# Altium schematic sheet sdcard.SchDoc
size A4
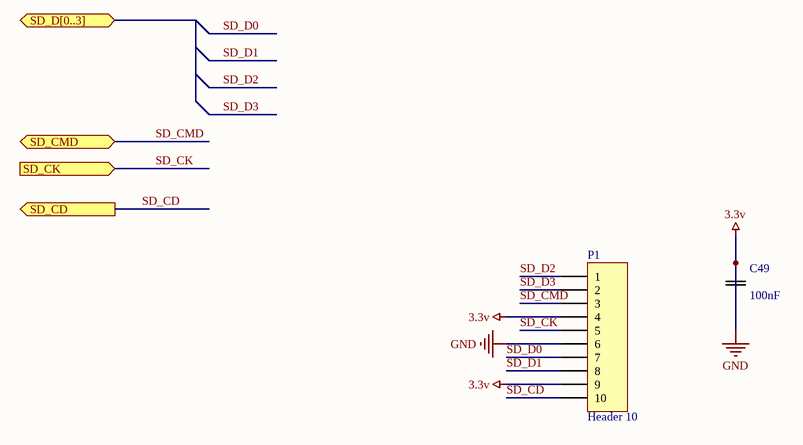
[diagram p0: sdcard.SchDoc]

## Parts
C49  100nF  [CAPC2013X110N]
P1  Header 10  [HDR1X10]

## Ports
SD_CD (out), SD_CK (in), SD_CMD (bidir), SD_D[0..3] (bidir)

## Nets
3.3v: C49.1(C1) C49.2(C2) P1.4 P1.6 P1.9  [also labelled GND]
SD_CD: P1.10 ; port SD_CD
SD_CK: P1.5 ; port SD_CK
SD_CMD: P1.3 ; port SD_CMD
SD_D0: P1.7
SD_D1: P1.8
SD_D2: P1.1
SD_D3: P1.2

## Library data of the parts
C49 = C0805C104K5RACTU: Capacitor; Ceramic; Cap; .100UF ; Tol+-10%; SMD; Vol-Rtg 50V; X7R, Tape/Reel; MF: Kemet; Package: 0805 Kemet; MP: C0805C104K5RACTU; Value: *
P1 = Header 10: Header, 10-Pin; LatestRevisionDate: 17-Jul-2002; LatestRevisionNote: Re-released for DXP Platform.; Publisher: Altium Limited